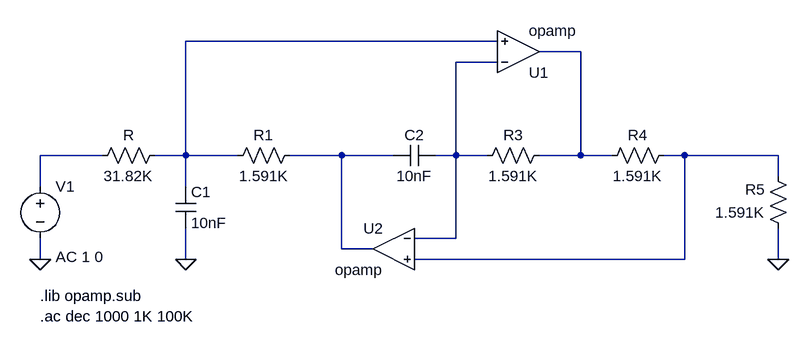
[diagram p0: schematic CircTarea1.asc]
CircTarea1.asc, the LTspice schematic file:
Version 4.1
SHEET 1 1060 680
WIRE 608 -64 128 -64
WIRE 736 -48 672 -48
WIRE 608 -32 544 -32
WIRE 0 112 -96 112
WIRE 128 112 128 -64
WIRE 128 112 80 112
WIRE 208 112 128 112
WIRE 368 112 288 112
WIRE 448 112 368 112
WIRE 544 112 544 -32
WIRE 544 112 512 112
WIRE 592 112 544 112
WIRE 736 112 736 -48
WIRE 736 112 672 112
WIRE 784 112 736 112
WIRE 896 112 864 112
WIRE 1040 112 896 112
WIRE 1040 144 1040 112
WIRE -96 160 -96 112
WIRE 128 160 128 112
WIRE 544 240 544 112
WIRE 544 240 480 240
WIRE 368 256 368 112
WIRE 416 256 368 256
WIRE -96 272 -96 240
WIRE 128 272 128 224
WIRE 896 272 896 112
WIRE 896 272 480 272
WIRE 1040 272 1040 224
FLAG 128 272 0
FLAG -96 272 0
FLAG 1040 272 0
SYMBOL voltage -96 144 R0
WINDOW 123 24 124 Left 2
WINDOW 39 0 0 Left 0
SYMATTR Value2 AC 1 0
SYMATTR InstName V1
SYMATTR Value ""
SYMBOL res 96 96 R90
WINDOW 0 0 56 VBottom 2
WINDOW 3 32 56 VTop 2
SYMATTR InstName R
SYMATTR Value 31.82K
SYMBOL cap 112 160 R0
SYMATTR InstName C1
SYMATTR Value 10nF
SYMBOL res 304 96 R90
WINDOW 0 0 56 VBottom 2
WINDOW 3 32 56 VTop 2
SYMATTR InstName R1
SYMATTR Value 1.591K
SYMBOL cap 512 96 R90
WINDOW 0 0 32 VBottom 2
WINDOW 3 32 32 VTop 2
SYMATTR InstName C2
SYMATTR Value 10nF
SYMBOL res 688 96 R90
WINDOW 0 0 56 VBottom 2
WINDOW 3 32 56 VTop 2
SYMATTR InstName R3
SYMATTR Value 1.591K
SYMBOL res 1056 240 R180
WINDOW 0 36 76 Left 2
WINDOW 3 36 40 Left 2
SYMATTR InstName R5
SYMATTR Value 1.591K
SYMBOL OpAmps\\opamp 640 16 M180
SYMATTR InstName U1
SYMBOL OpAmps\\opamp 448 192 M0
SYMATTR InstName U2
SYMBOL res 880 96 R90
WINDOW 0 0 56 VBottom 2
WINDOW 3 32 56 VTop 2
SYMATTR InstName R4
SYMATTR Value 1.591K
TEXT -96 328 Left 2 !.lib opamp.sub
TEXT -96 360 Left 2 !.ac dec 1000 1K 100K

The netlist it stands for:
* CircTarea1.asc
V1 N004 0 AC 1 0
R N001 N004 31.82K
C1 N001 0 10nF
R1 N005 N001 1.591K
C2 N003 N005 10nF
R3 N002 N003 1.591K
R5 0 N006 1.591K
X§U1 N003 N001 N002 opamp Aol=100K GBW=10Meg  ; pins invin noninvin out
X§U2 N003 N006 N005 opamp Aol=100K GBW=10Meg  ; pins invin noninvin out
R4 N006 N002 1.591K
.lib opamp.sub
.ac dec 1000 1K 100K
.backanno
.end